# Altium schematic sheet Macropad.SchDoc: Macropad
size A3; SheetNumber: 1; SheetTotal: 1
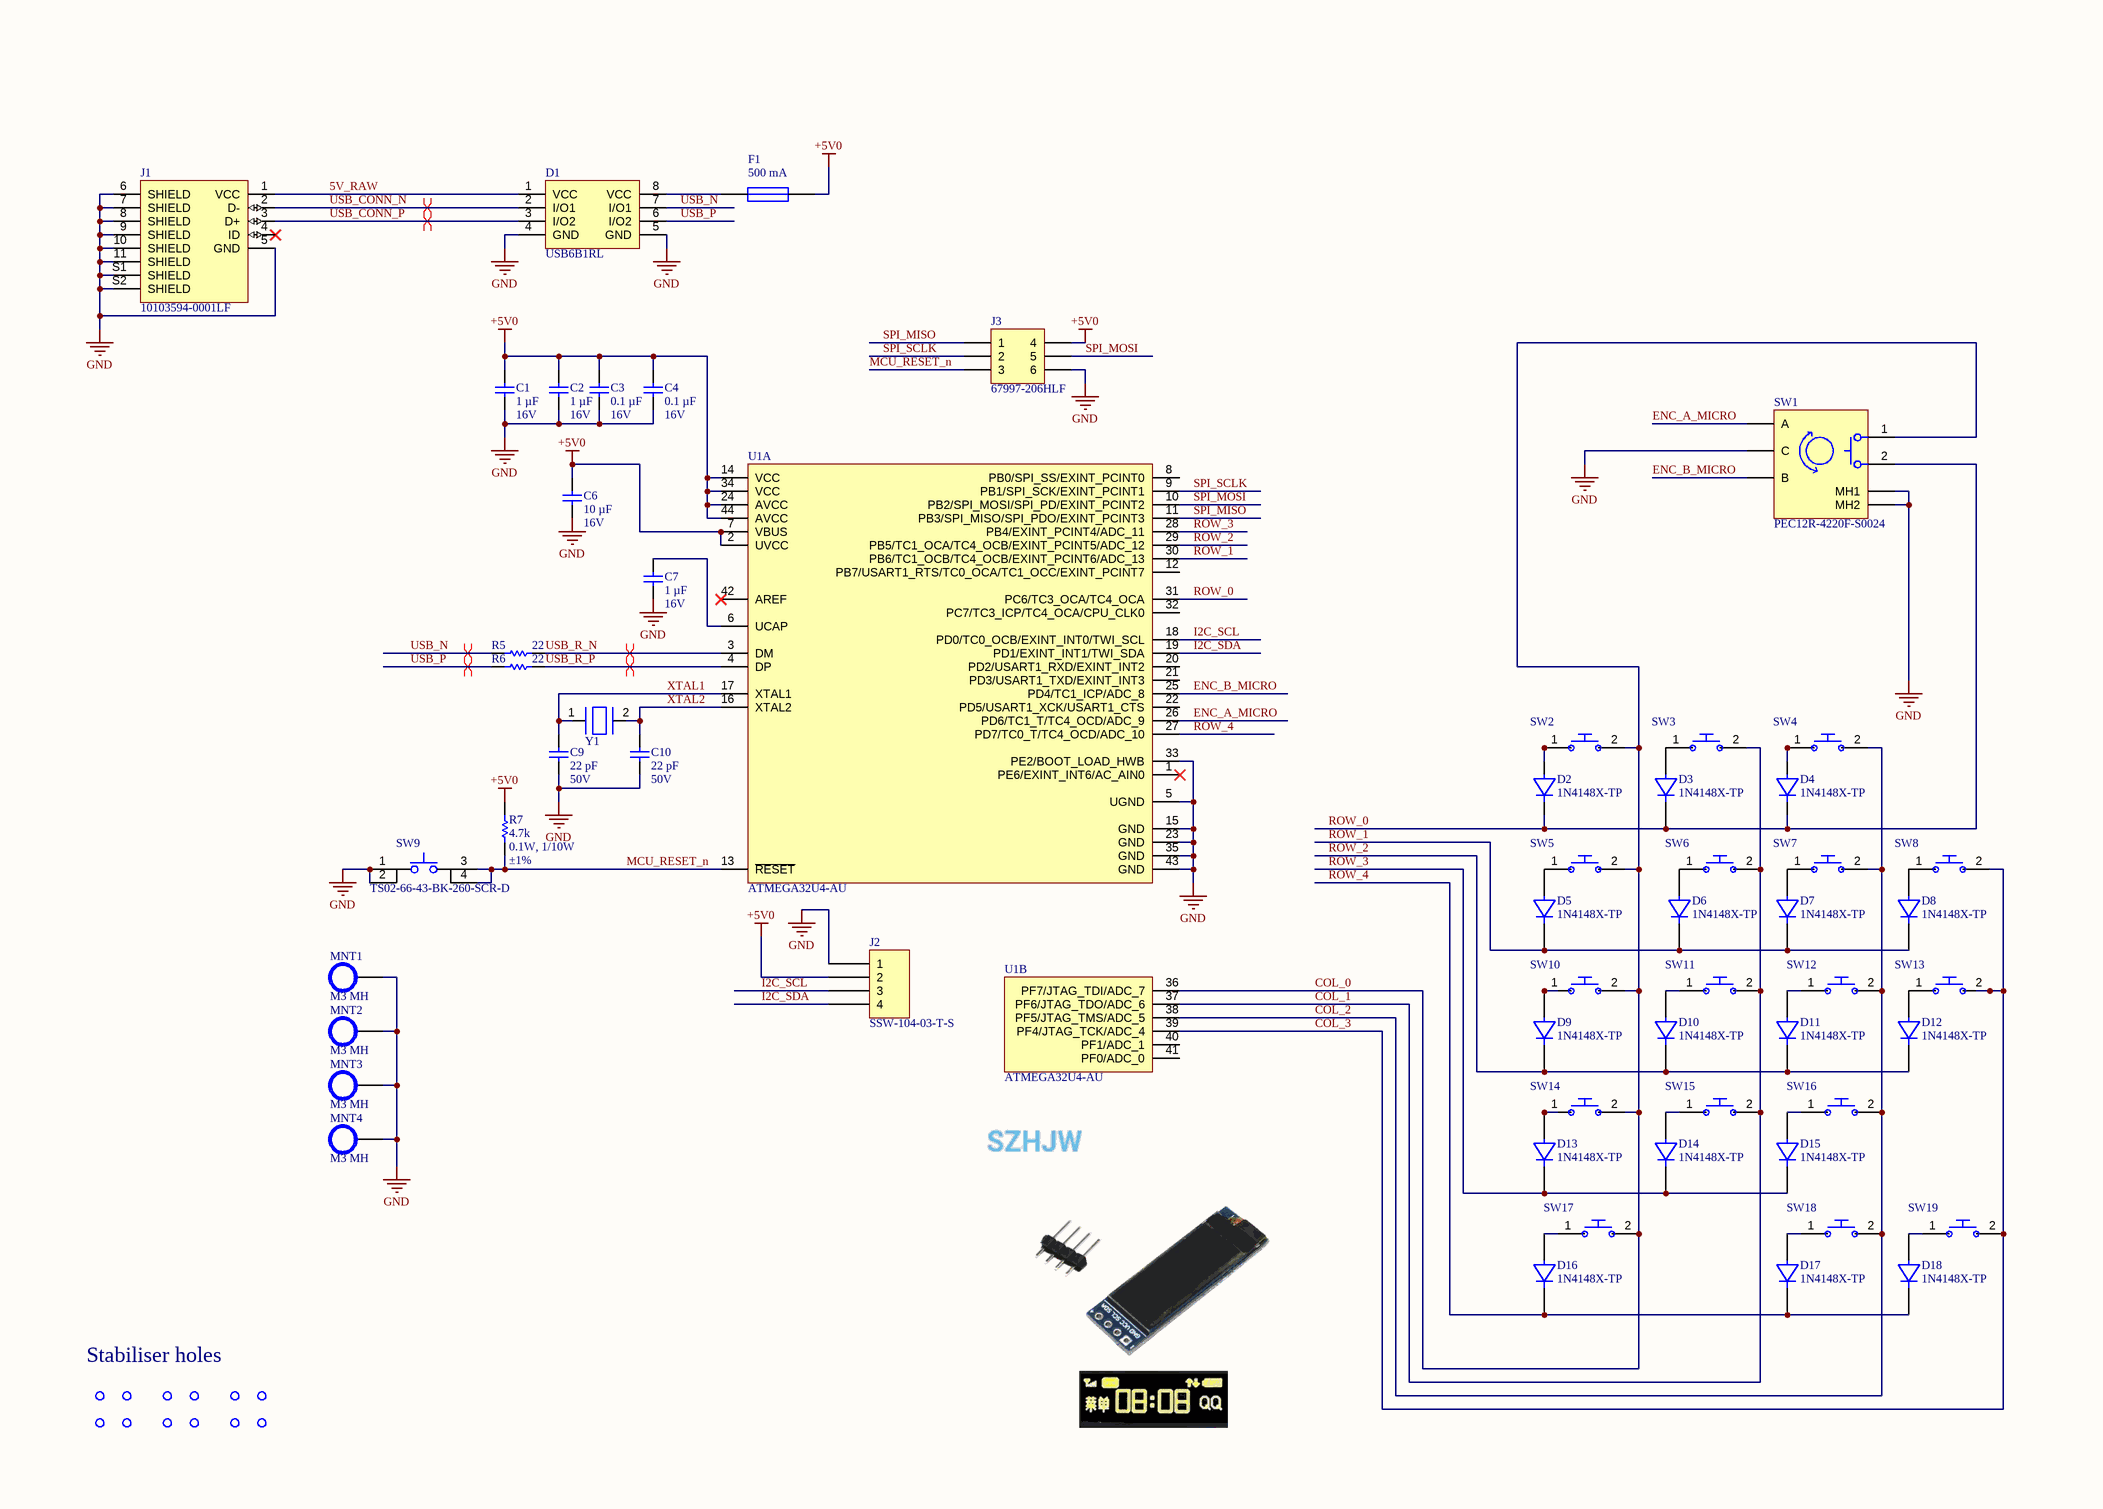
[diagram p0: Macropad.SchDoc]

## Parts
C1  Capacitance: 1 µF  Voltage Rating: 16V  [C_1608_0603]  (hidden comment: 0603YC105KAT2A)
C2  Capacitance: 1 µF  Voltage Rating: 16V  [C_1608_0603]  (hidden comment: 0603YC105KAT2A)
C3  Capacitance: 0.1 µF  Voltage Rating: 16V  [C_1608_0603]  (hidden comment: 0603YC104KAT2A)
C4  Capacitance: 0.1 µF  Voltage Rating: 16V  [C_1608_0603]  (hidden comment: 0603YC104KAT2A)
C6  Capacitance: 10 µF  Voltage Rating: 16V  [C_2012_0805]  (hidden comment: 0805YC106KAT2A)
C7  Capacitance: 1 µF  Voltage Rating: 16V  [C_1608_0603]  (hidden comment: 0603YC105KAT2A)
C9  Capacitance: 22 pF  Voltage Rating: 50V  [C_1608_0603]  (hidden comment: 06035A220JAT2A)
C10  Capacitance: 22 pF  Voltage Rating: 50V  [C_1608_0603]  (hidden comment: 06035A220JAT2A)
D1  USB6B1RL  [SOIC_8_1270_4900X3900X1750_ST_SO-8]
D2  1N4148X-TP  [D_MCC_SOD-523]
D3  1N4148X-TP  [D_MCC_SOD-523]
D4  1N4148X-TP  [D_MCC_SOD-523]
D5  1N4148X-TP  [D_MCC_SOD-523]
D6  1N4148X-TP  [D_MCC_SOD-523]
D7  1N4148X-TP  [D_MCC_SOD-523]
D8  1N4148X-TP  [D_MCC_SOD-523]
D9  1N4148X-TP  [D_MCC_SOD-523]
D10  1N4148X-TP  [D_MCC_SOD-523]
D11  1N4148X-TP  [D_MCC_SOD-523]
D12  1N4148X-TP  [D_MCC_SOD-523]
D13  1N4148X-TP  [D_MCC_SOD-523]
D14  1N4148X-TP  [D_MCC_SOD-523]
D15  1N4148X-TP  [D_MCC_SOD-523]
D16  1N4148X-TP  [D_MCC_SOD-523]
D17  1N4148X-TP  [D_MCC_SOD-523]
D18  1N4148X-TP  [D_MCC_SOD-523]
F1  Current Rating: 500 mA  [FUSE_2012_0805_BELFUSE]  (hidden comment: 0ZCK0050FF2E)
J1  10103594-0001LF  [CONN_10103594-0001LF]
J2  SSW-104-03-T-S  [SAMTEC SSW-104-03-T-S]
J3  67997-206HLF  [CONN_2X3_HDR_2540]
MNT1  Display Name: M3 MH  [MH_M3_PTH_VIA-SPOKES]  (hidden comment: M3 Mounting Hole)  (no BOM)
MNT2  Display Name: M3 MH  [MH_M3_PTH_VIA-SPOKES]  (hidden comment: M3 Mounting Hole)  (no BOM)
MNT3  Display Name: M3 MH  [MH_M3_PTH_VIA-SPOKES]  (hidden comment: M3 Mounting Hole)  (no BOM)
MNT4  Display Name: M3 MH  [MH_M3_PTH_VIA-SPOKES]  (hidden comment: M3 Mounting Hole)  (no BOM)
R5  Resistance: 22  [R_1608_0603]  (hidden comment: RMCF0603FT22R0)
R6  Resistance: 22  [R_1608_0603]  (hidden comment: RMCF0603FT22R0)
R7  Resistance: 4.7k  Power Rating: 0.1W, 1/10W  Tolerance: ±1%  [R_1608_0603]  (hidden comment: RMCF0603FT4K70)
STAB1  Cherry Stabiliser Hole  [HOLE_CHERRY_STAB]  (value not drawn)
STAB2  Cherry Stabiliser Hole  [HOLE_CHERRY_STAB]  (value not drawn)
STAB3  Cherry Stabiliser Hole  [HOLE_CHERRY_STAB]  (value not drawn)
SW1  PEC12R-4220F-S0024  [SW_ENCODER_PEC12R-4220F-S0024]
SW2  MX-Style Switch  [SW_CHERRY-MX-STYLE]  (value not drawn)
SW3  MX-Style Switch  [SW_CHERRY-MX-STYLE]  (value not drawn)
SW4  MX-Style Switch  [SW_CHERRY-MX-STYLE]  (value not drawn)
SW5  MX-Style Switch  [SW_CHERRY-MX-STYLE]  (value not drawn)
SW6  MX-Style Switch  [SW_CHERRY-MX-STYLE]  (value not drawn)
SW7  MX-Style Switch  [SW_CHERRY-MX-STYLE]  (value not drawn)
SW8  MX-Style Switch  [SW_CHERRY-MX-STYLE]  (value not drawn)
SW9  TS02-66-43-BK-260-SCR-D  [TS02-66-43-BK-260-SCR-D]
SW10  MX-Style Switch  [SW_CHERRY-MX-STYLE]  (value not drawn)
SW11  MX-Style Switch  [SW_CHERRY-MX-STYLE]  (value not drawn)
SW12  MX-Style Switch  [SW_CHERRY-MX-STYLE]  (value not drawn)
SW13  MX-Style Switch  [SW_CHERRY-MX-STYLE]  (value not drawn)
SW14  MX-Style Switch  [SW_CHERRY-MX-STYLE]  (value not drawn)
SW15  MX-Style Switch  [SW_CHERRY-MX-STYLE]  (value not drawn)
SW16  MX-Style Switch  [SW_CHERRY-MX-STYLE]  (value not drawn)
SW17  MX-Style Switch  [SW_CHERRY-MX-STYLE]  (value not drawn)
SW18  MX-Style Switch  [SW_CHERRY-MX-STYLE]  (value not drawn)
SW19  MX-Style Switch  [SW_CHERRY-MX-STYLE]  (value not drawn)
U1  ATMEGA32U4-AU  [QFP_44_800_1200X1200X120_ATMEL]  (parts A,B of 2)
Y1  830036034  [Y_XTAL_HC49]  (value not drawn)

## Nets
+5V0: C1.2 C2.2 C3.2 C4.2 C6.2 F1.2 J2.2 J3.4 R7.2 U1.2(UVCC) U1.7(VBUS) U1.14(VCC) U1.24(AVCC) U1.34(VCC) U1.44(AVCC)
GND: C1.1 C2.1 C3.1 C4.1 C6.1 C7.1 C9.2 C10.2 D1.4(GND) D1.5(GND) J1.5(GND) J1.6(SHIELD) J1.7(SHIELD) J1.8(SHIELD) J1.9(SHIELD) J1.10(SHIELD) J1.11(SHIELD) J1.S1(SHIELD) J1.S2(SHIELD) J2.1 J3.6 MNT1.1 MNT2.1 MNT3.1 MNT4.1 SW1.C SW1.MH1 SW1.MH2 SW9.1 SW9.2 U1.5(UGND) U1.15(GND) U1.23(GND) U1.33(PE2/BOOT_LOAD_HWB) U1.35(GND) U1.43(GND)
5V_RAW: D1.1(VCC) J1.1(VCC)
COL_0: SW1.1 SW2.2 SW5.2 SW10.2 SW14.2 SW17.2 U1.36(PF7/JTAG_TDI/ADC_7)
COL_1: SW3.2 SW6.2 SW11.2 SW15.2 U1.37(PF6/JTAG_TDO/ADC_6)
COL_2: SW4.2 SW7.2 SW12.2 SW16.2 SW18.2 U1.38(PF5/JTAG_TMS/ADC_5)
COL_3: SW8.2 SW13.2 SW19.2 U1.39(PF4/JTAG_TCK/ADC_4)
ENC_A_MICRO: SW1.A U1.26(PD6/TC1_T/TC4_OCD/ADC_9)
ENC_B_MICRO: SW1.B U1.25(PD4/TC1_ICP/ADC_8)
I2C_SCL: J2.3 U1.18(PD0/TC0_OCB/EXINT_INT0/TWI_SCL)
I2C_SDA: J2.4 U1.19(PD1/EXINT_INT1/TWI_SDA)
MCU_RESET_n: J3.3 R7.1 SW9.3 SW9.4 U1.13(~{RESET})
ROW_0: D2.1(Cathode) D3.1(Cathode) D4.1(Cathode) SW1.2 U1.31(PC6/TC3_OCA/TC4_OCA)
ROW_1: D5.1(Cathode) D6.1(Cathode) D7.1(Cathode) D8.1(Cathode) U1.30(PB6/TC1_OCB/TC4_OCB/EXINT_PCINT6/ADC_13)
ROW_2: D9.1(Cathode) D10.1(Cathode) D11.1(Cathode) D12.1(Cathode) U1.29(PB5/TC1_OCA/TC4_OCB/EXINT_PCINT5/ADC_12)
ROW_3: D13.1(Cathode) D14.1(Cathode) D15.1(Cathode) U1.28(PB4/EXINT_PCINT4/ADC_11)
ROW_4: D16.1(Cathode) D17.1(Cathode) D18.1(Cathode) U1.27(PD7/TC0_T/TC4_OCD/ADC_10)
SPI_MISO: J3.1 U1.11(PB3/SPI_MISO/SPI_PDO/EXINT_PCINT3)
SPI_MOSI: J3.5 U1.10(PB2/SPI_MOSI/SPI_PD/EXINT_PCINT2)
SPI_SCLK: J3.2 U1.9(PB1/SPI_SCK/EXINT_PCINT1)
USB_CONN_N: D1.2(I/O1) J1.2(D-)
USB_CONN_P: D1.3(I/O2) J1.3(D+)
USB_N: D1.7(I/O1) R5.1
USB_P: D1.6(I/O2) R6.1
USB_R_N: R5.2 U1.3(DM)
USB_R_P: R6.2 U1.4(DP)
XTAL1: C9.1 U1.17(XTAL1) Y1.1
XTAL2: C10.1 U1.16(XTAL2) Y1.2
NetC7_2: C7.2 U1.6(UCAP)
NetD1_8: D1.8(VCC) F1.1
NetD2_2: D2.2(Anode) SW2.1
NetD3_2: D3.2(Anode) SW3.1
NetD4_2: D4.2(Anode) SW4.1
NetD5_2: D5.2(Anode) SW5.1
NetD6_2: D6.2(Anode) SW6.1
NetD7_2: D7.2(Anode) SW7.1
NetD8_2: D8.2(Anode) SW8.1
NetD9_2: D9.2(Anode) SW10.1
NetD10_2: D10.2(Anode) SW11.1
NetD11_2: D11.2(Anode) SW12.1
NetD12_2: D12.2(Anode) SW13.1
NetD13_2: D13.2(Anode) SW14.1
NetD14_2: D14.2(Anode) SW15.1
NetD15_2: D15.2(Anode) SW16.1
NetD16_2: D16.2(Anode) SW17.1
NetD17_2: D17.2(Anode) SW18.1
NetD18_2: D18.2(Anode) SW19.1

Not connected (* = marked no-connect by the designer): J1 4(ID)*; U1 1(PE6/EXINT_INT6/AC_AIN0)* 8(PB0/SPI_SS/EXINT_PCINT0) 12(PB7/USART1_RTS/TC0_OCA/TC1_OCC/EXINT_PCINT7) 20(PD2/USART1_RXD/EXINT_INT2) 21(PD3/USART1_TXD/EXINT_INT3) 22(PD5/USART1_XCK/USART1_CTS) 32(PC7/TC3_ICP/TC4_OCA/CPU_CLK0) 40(PF1/ADC_1) 41(PF0/ADC_0) 42(AREF)*

## Layout directives
differential pair; differential pair class DIFF90: USB_CONN_N, USB_CONN_P, USB_N, USB_P, USB_R_N, USB_R_P

## Notes on the sheet
- Stabiliser holes
- THIS DOCUMENT AND THE DATA DISCLOSED HEREIN OR
- HEREWITH IS THE PROPERTY OF ALTIUM LIMITED AND MAY
- DWG NO:
- REVISION
- REV:
- DESCRIPTION
- DATE
- APPROVED
- BE FREELY DISTRIBUTED IN WHOLE. NO RIGHTS ARE
- RESERVED OR EXPRESS OR IMPLIED WARANTEE GIVEN.
- ENG:
- APPROVALS
- PROJECT
- DSN:
- CHK:
- REFERENCE DOCUMENTS
- PROJECT REVISION:
- TITLE
- DOCUMENT REVISION:
- DESIGN ITEM:
- BOM:
- FAB DWG:
- PCB DWG:
- ASSY DWG:
- SCALE:
- A3
- SIZE
- CAGE CODE
- FILE NAME
- DWG NO.
- SHEET
- OF
- REV

## Library data of the parts
C1 C2 C7 = 0603YC105KAT2A: CAP CER 1UF 16V X7R 0603; Manufacturer: KYOCERA AVX; Tolerance: ±10%; PN: 0603YC105KAT2A; Package: 0603 (1608 Metric); Dielectric: X7R; Rating: -; Supplier 1: Digi-Key; Supplier Part Number 1: 478-5010-1-ND; Max Operating Temperature: 125°C; Min Operating Temperature: -55°C; ComponentLink1Description: Datasheet; ComponentLink1URL: https://datasheets.kyocera-avx.com/X7RDielectric.pdf
C3 C4 = 0603YC104KAT2A: CAP CER 0.1UF 16V X7R 0603; Manufacturer: KYOCERA AVX; Tolerance: ±10%; PN: 0603YC104KAT2A; Package: 0603 (1608 Metric); Dielectric: X7R; Rating: -; Supplier 1: Digi-Key; Supplier Part Number 1: 478-1239-1-ND; Max Operating Temperature: 125°C; Min Operating Temperature: -55°C; ComponentLink1Description: Datasheet; ComponentLink1URL: https://datasheets.kyocera-avx.com/X7RDielectric.pdf
C6 = 0805YC106KAT2A: CAP MLCC 10UF 16V 0805; Manufacturer: KYOCERA AVX; Tolerance: ±10%; Dielectric: X7R; PN: 0805YC106KAT2A; Package: 0805 (2012 Metric); Rating: -; Supplier 1: Digi-Key; Supplier Part Number 1: 478-0805YC106KAT2ACT-ND; Max Operating Temperature: 125°C; Min Operating Temperature: -55°C; ComponentLink1Description: Datasheet; ComponentLink1URL: https://datasheets.kyocera-avx.com/X7RDielectric.pdf
C9 C10 = 06035A220JAT2A: CAP CER 22PF 50V C0G/NP0 0603; Manufacturer: KYOCERA AVX; Tolerance: ±5%; Dielectric: C0G, NP0; PN: 06035A220JAT2A; Rating: -; Supplier 1: Digi-Key; Supplier Part Number 1: 478-1167-1-ND; Max Operating Temperature: 125°C; Min Operating Temperature: -55°C; ComponentLink1Description: Datasheet; ComponentLink1URL: https://datasheets.kyocera-avx.com/C0GNP0-Dielectric.pdf
D1 = USB6B1RL: TVS DIODE 5.25VWM 8-SO; Manufacturer: STMicroelectronics; PN: USB6B1RL; Supplier 1: Digi-Key; Supplier Part Number 1: 497-3281-1-ND; Max Operating Temperature: 85°C (TA); Min Operating Temperature: -40°C; ComponentLink1Description: Datasheet; ComponentLink1URL: https://www.st.com/content/ccc/resource/technical/document/datasheet/3e/ec/b2/54/b2/76/47/90/CD00001361.pdf/files/CD00001361.pdf/jcr:content/translations/en.CD00001361.pdf
D2-D18 = 1N4148X-TP: DIODE GEN PURP 75V 150MA SOD523; Manufacturer: Micro Commercial Co; ComponentLink1Description: Datasheet; ComponentLink1URL: https://www.mccsemi.com/pdf/Products/1N4148X(SOD-523).PDF; Supplier 1: Digi-Key; Supplier Part Number 1: 1N4148XTPMSCT-ND; PN: 1N4148X-TP; Package: SOD523; Max Operating Temperature: 150°C; Min Operating Temperature: -65°C
F1 = 0ZCK0050FF2E: PTC RESET FUSE 6V 500MA 0805; Manufacturer: Bel Fuse Inc.; Response Time: 100 ms; PN: 0ZCK0050FF2E; Package: 0805; Supplier 1: Digi-Key; Supplier Part Number 1: 507-1813-1-ND; Max Operating Temperature: 85°C; Min Operating Temperature: -40°C; ComponentLink1Description: Datasheet; ComponentLink1URL: https://www.belfuse.com/resources/datasheets/circuitprotection/ds-cp-0zck-series.pdf
J1 = 10103594-0001LF: CONN RCPT USB2.0 MICRO B SMD R/A; Manufacturer: Amphenol ICC (FCI); Gender: Receptacle; System: Connector; Value: *; MP: 10103594-0001LF; Package: None; Availability: Unavailable; Price: None; PN: 10103594-0001LF; Pin Count: 5; Supplier 1: Digi-Key; Supplier Part Number 1: 609-4050-1-ND; Max Operating Temperature: 80°C; Min Operating Temperature: -30°C; ComponentLink1Description: Datasheet; ComponentLink1URL: https://cdn.amphenol-cs.com/media/wysiwyg/files/drawing/10103594.pdf
J2 = SSW-104-03-T-S: CONN RCPT 4POS 0.1 TIN PCB; Manufacturer: Samtec Inc.; Connector Type: Receptacle; Current Rating (Amps): 5.7A per Contact; Material Flammability Rating: UL94 V-0; Number of Positions: 4; Number of Positions Loaded: All; Style: Board to Board or Cable; Part Number: SSW-104-03-T-S; ComponentLink2Description: DigiKey Link; ComponentLink2URL: http://digikey.com/product-detail/en/samtec-inc/SSW-104-03-T-S/SSW-104-03-T-S-ND/7874034; Contact Finish - Mating: Tin; Contact Finish - Post: Tin; Contact Type: Forked; Fastening Type: Push-Pull; Insulation Color: Black; LastUpdated: 2022-06-21 15:08:52; Lifecycle Status: Active; Minimum Order: 1; Mounting Type: Through Hole; Number of Rows: 1; Operating Temperature: -55°C ~ 105°C; Packaging: Bulk; Part Status: Active; Price: 0.83; Series: SSW; Supplier 1: DigiKey; Supplier Part Number 1: SSW-104-03-T-S-ND; Termination: Solder
J3 = 67997-206HLF: CONN HEADER VERT 6POS 2.54MM; Manufacturer: Amphenol ICC (FCI); System: Connector; PN: 67997-206HLF; Pin Count: 6; Gender: Header; Supplier 1: Digi-Key; Supplier Part Number 1: 609-3234-ND; ComponentLink1Description: Datasheet; ComponentLink1URL: https://cdn.amphenol-cs.com/media/wysiwyg/files/drawing/67996.pdf
R5 R6 = RMCF0603FT22R0: RES 22 OHM 1% 1/10W 0603; Manufacturer: Stackpole Electronics Inc; Power Rating: 0.1W, 1/10W; PN: RMCF0603FT22R0; Package: 0603; Tolerance: ±1%; Supplier 1: Digi-Key; Supplier Part Number 1: RMCF0603FT22R0CT-ND; Max Operating Temperature: 155°C; Min Operating Temperature: -55°C; ComponentLink1Description: Datasheet; ComponentLink1URL: https://www.seielect.com/catalog/sei-rmcf_rmcp.pdf
R7 = RMCF0603FT4K70: RES 4.7K OHM 1% 1/10W 0603; Manufacturer: Stackpole Electronics Inc; PN: RMCF0603FT4K70; Package: 0603; Supplier 1: Digi-Key; Supplier Part Number 1: RMCF0603FT4K70CT-ND; Max Operating Temperature: 155°C; Min Operating Temperature: -55°C; ComponentLink1Description: Datasheet; ComponentLink1URL: https://www.seielect.com/catalog/sei-rmcf_rmcp.pdf
SW1 = PEC12R-4220F-S0024: ROTARY ENCODER MECHANICAL 24PPR; Manufacturer: Bourns Inc.; PN: PEC12R-4220F-S0024; ComponentLink1Description: Datasheet; ComponentLink1URL: https://www.bourns.com/docs/Product-Datasheets/PEC12R.pdf
U1 = ATMEGA32U4-AU: IC MCU 8BIT 32KB FLASH 44TQFP; Manufacturer: Microchip Technology; PN: ATMEGA32U4-AU; Package: 44-TQFP; Supplier 1: Digi-Key; Supplier Part Number 1: ATMEGA32U4-AU-ND; Max Operating Temperature: 85°C (TA); Min Operating Temperature: -40°C; ComponentLink1Description: Datasheet; ComponentLink1URL: https://ww1.microchip.com/downloads/en/DeviceDoc/Atmel-7766-8-bit-AVR-ATmega16U4-32U4_Datasheet.pdf
Y1 = 830036034: WE-XTAL QUARTZ CRYSTAL 16.0 MHZ;; Manufacturer: Würth Elektronik; Frequency: 16 MHz; Precision: ±50ppm; Load Capacitance: 16pF; PN: 830036034; Package: HC-49/US; ComponentLink1Description: Datasheet; ComponentLink1URL: https://www.mouser.com/datasheet/2/445/830036034-2005457.pdf
MNT1-MNT4 = M3 Mounting Hole: PN: M3 Mounting Hole; ComponentLink1Description: Datasheet
STAB1-STAB3 = Cherry Stabiliser Hole: PN: Cherry Stabiliser Hole; ComponentLink1Description: Datasheet
SW2-SW8 SW10-SW19 = MX-Style Switch: PN: MX-Style Switch; ComponentLink1Description: Datasheet